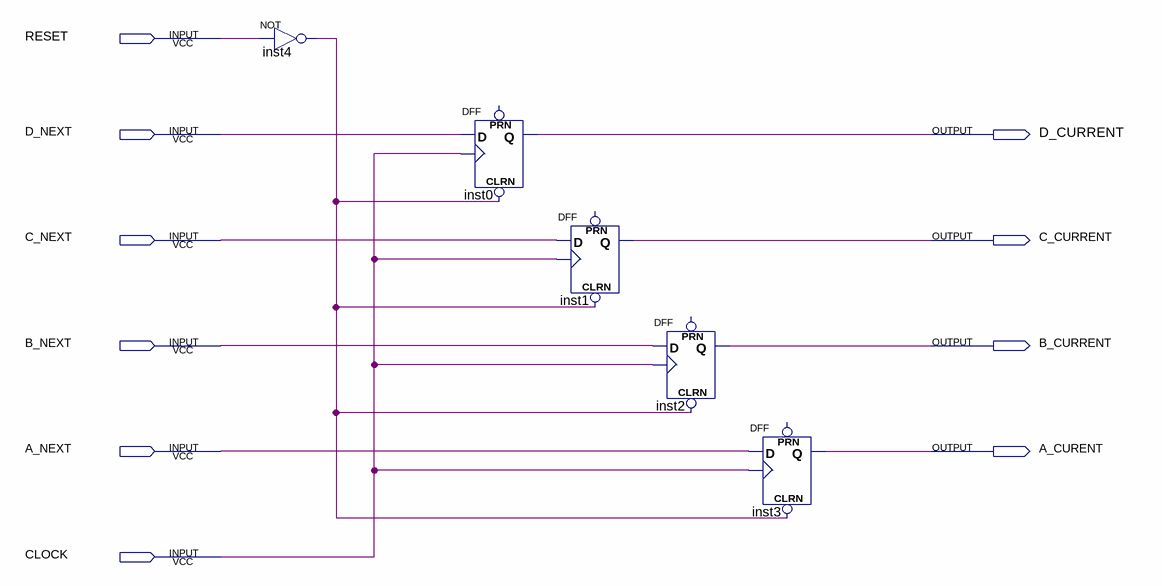
[diagram p0: schematic sheet]
// Quartus schematic Registrador.bdf as structural Verilog: 5 symbols, 10 pins
module Registrador (
  input  RESET,
  input  D_NEXT,
  input  C_NEXT,
  input  B_NEXT,
  input  A_NEXT,
  input  CLOCK,
  output D_CURRENT,
  output C_CURRENT,
  output B_CURRENT,
  output A_CURENT
);

  wire inst4_out;

  not inst4 (inst4_out, RESET);
  DFF inst0 (.CLRN(inst4_out), .CLK(CLOCK), .D(D_NEXT), .Q(D_CURRENT));  // open: PRN
  DFF inst1 (.CLRN(inst4_out), .CLK(CLOCK), .D(C_NEXT), .Q(C_CURRENT));  // open: PRN
  DFF inst2 (.CLRN(inst4_out), .CLK(CLOCK), .D(B_NEXT), .Q(B_CURRENT));  // open: PRN
  DFF inst3 (.CLRN(inst4_out), .CLK(CLOCK), .D(A_NEXT), .Q(A_CURENT));  // open: PRN
endmodule
